# Altium schematic sheet Power.SchDoc
size 420 x 297 mm; SheetNumber: 2; SheetTotal: 6
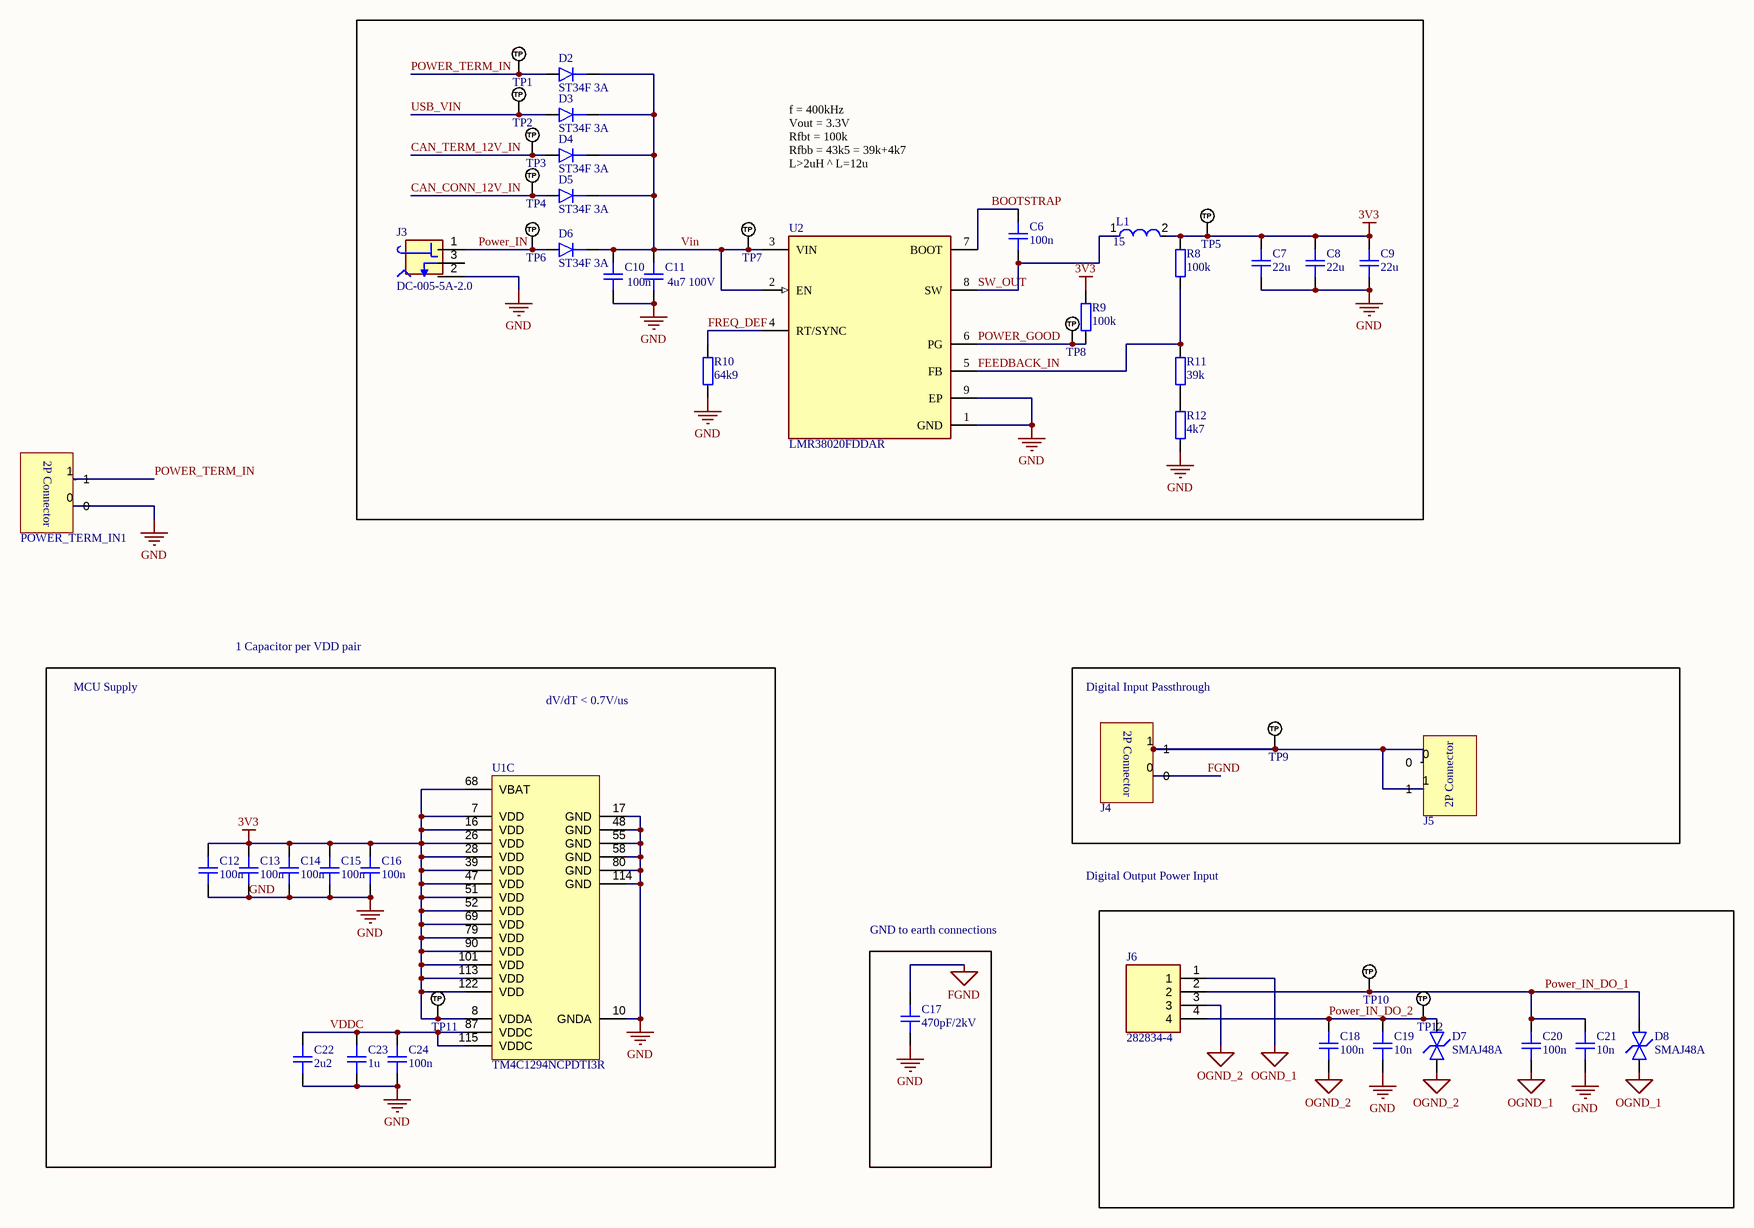
[diagram p0: Power.SchDoc]

## Parts
C6  100n  [CAP_0402]
C7  22u  [CAP_1206]
C8  22u  [CAP_1206]
C9  22u  [CAP_1206]
C10  100n  [CAP_1206]
C11  4u7 100V  [CAP_1206]
C12  100n  [CAP_0402]
C13  100n  [CAP_0402]
C14  100n  [CAP_0402]
C15  100n  [CAP_0402]
C16  100n  [CAP_0402]
C17  470pF/2kV  [CAP_1206]
C18  100n  [CAP_0603]
C19  10n  [CAP_0603]
C20  100n  [CAP_0603]
C21  10n  [CAP_0603]
C22  2u2  [CAP_0402]
C23  1u  [CAP_0402]
C24  100n  [CAP_0402]
D2  ST34F 3A  [DO-214AC-2 (SMA)]
D3  ST34F 3A  [DO-214AC-2 (SMA)]
D4  ST34F 3A  [DO-214AC-2 (SMA)]
D5  ST34F 3A  [DO-214AC-2 (SMA)]
D6  ST34F 3A  [DO-214AC-2 (SMA)]
D7  SMAJ48A  [DO-214AC-2 (SMA)]
D8  SMAJ48A  [DO-214AC-2 (SMA)]
J3  DC-005-5A-2.0  [XKB_DC-005-5A-2.0]
J4  DG308-2.54-02P-12-00AH  [DG308-2.54-02P-12-00AH-Footprint-1]  (value not drawn)
J5  DG308-2.54-02P-12-00AH  [DG308-2.54-02P-12-00AH-Footprint-1]  (value not drawn)
J6  282834-4  [TE_282834-4]
L1  15  [FP-SPM10040-MFG]
POWER_TERM_IN1  DG308-2.54-02P-12-00AH  [DG308-2.54-02P-12-00AH-Footprint-1]  (value not drawn)
R8  100k  [RES_0402]
R9  100k  [RES_0402]
R10  64k9  [RES_0402]
R11  39k  [RES_0402]
R12  4k7  [RES_0402]
TP1  TP_NOBOM  [PAD_RND_1MM]  (value not drawn)  (no BOM)
TP2  TP_NOBOM  [PAD_RND_1MM]  (value not drawn)  (no BOM)
TP3  TP_NOBOM  [PAD_RND_1MM]  (value not drawn)  (no BOM)
TP4  TP_NOBOM  [PAD_RND_1MM]  (value not drawn)  (no BOM)
TP5  TP_NOBOM  [PAD_RND_1MM]  (value not drawn)  (no BOM)
TP6  TP_NOBOM  [PAD_RND_1MM]  (value not drawn)  (no BOM)
TP7  TP_NOBOM  [PAD_RND_1MM]  (value not drawn)  (no BOM)
TP8  TP_NOBOM  [PAD_RND_1MM]  (value not drawn)  (no BOM)
TP9  TP_NOBOM  [PAD_RND_1MM]  (value not drawn)  (no BOM)
TP10  TP_NOBOM  [PAD_RND_1MM]  (value not drawn)  (no BOM)
TP11  TP_NOBOM  [PAD_RND_1MM]  (value not drawn)  (no BOM)
TP12  TP_NOBOM  [PAD_RND_1MM]  (value not drawn)  (no BOM)
U1  TM4C1294NCPDTI3R  [PDT0128A_M]  (part C of 3)
U2  LMR38020FDDAR  [FP-DDA0008E-IPC_C]

## Blocks framed on the sheet
Digital Input Passthrough: J4 J5 TP9
GND to earth connections: C17

## Nets
3V3: C7.2 C8.2 C9.2 C12.2 C13.2 C14.2 C15.2 C16.2 L1.2 R8.2 R9.2 TP5.1(TP) TP11.1(TP) U1.7(VDD) U1.8(VDDA) U1.16(VDD) U1.26(VDD) U1.28(VDD) U1.39(VDD) U1.47(VDD) U1.51(VDD) U1.52(VDD) U1.68(VBAT) U1.69(VDD) U1.79(VDD) U1.90(VDD) U1.101(VDD) U1.113(VDD) U1.122(VDD)
FGND: C17.2 J4.0
GND: C7.1 C8.1 C9.1 C10.1 C11.1 C12.1 C13.1 C14.1 C15.1 C16.1 C17.1 C19.1 C21.1 C22.1 C23.1 C24.1 J3.2 POWER_TERM_IN1.0 R10.1 R12.1 U1.10(GNDA) U1.17(GND) U1.48(GND) U1.55(GND) U1.58(GND) U1.80(GND) U1.114(GND) U2.1(GND) U2.9(EP)
OGND_1: C20.1 D8.A J6.1
OGND_2: C18.1 D7.A J6.3
BOOTSTRAP: C6.2 U2.7(BOOT)
CAN_CONN_12V_IN: D5.A TP4.1(TP)
CAN_TERM_12V_IN: D4.A TP3.1(TP)
FEEDBACK_IN: R8.1 R11.2 U2.5(FB)
FREQ_DEF: R10.2 U2.4(RT/SYNC)
POWER_GOOD: R9.1 TP8.1(TP) U2.6(PG)
Power_IN: D6.A J3.1 TP6.1(TP)
Power_IN_DO_1: C20.2 C21.2 D8.K J6.2 TP10.1(TP)
Power_IN_DO_2: C18.2 C19.2 D7.K J6.4 TP12.1(TP)
POWER_TERM_IN: D2.A POWER_TERM_IN1.1 TP1.1(TP)
SW_OUT: C6.1 L1.1 U2.8(SW)
USB_VIN: D3.A TP2.1(TP)
VDDC: C22.2 C23.2 C24.2 U1.87(VDDC) U1.115(VDDC)
Vin: C10.2 C11.2 D2.K D3.K D4.K D5.K D6.K TP7.1(TP) U2.2(EN) U2.3(VIN)
NetJ4_1: J4.1 J5.0 J5.1 TP9.1(TP)
NetR11_1: R11.1 R12.2

Not connected (* = marked no-connect by the designer): J3 3

## Notes on the sheet
- f = 400kHz
  Vout = 3.3V
  Rfbt = 100k
  Rfbb = 43k5 = 39k+4k7
  L>2uH ^ L=12u
- 1 Capacitor per VDD pair
- MCU Supply
- dV/dT < 0.7V/us
- Digital Output Power Input
- THIS DOCUMENT AND THE DATA DISCLOSED HEREIN OR
- HEREWITH IS THE PROPERTY OF ALTIUM LIMITED AND MAY
- DWG NO:
- REVISION
- REV:
- DESCRIPTION
- DATE
- APPROVED
- BE FREELY DISTRIBUTED IN WHOLE. NO RIGHTS ARE
- RESERVED OR EXPRESS OR IMPLIED WARANTEE GIVEN.
- ENG:
- APPROVALS
- PROJECT
- DSN:
- CHK:
- REFERENCE DOCUMENTS
- PROJECT REVISION:
- TITLE
- DOCUMENT REVISION:
- DESIGN ITEM:
- BOM:
- FAB DWG:
- PCB DWG:
- ASSY DWG:
- SCALE:
- A3
- SIZE
- CAGE CODE
- FILE NAME
- DWG NO.
- SHEET
- OF
- REV
- (in symbol CMP-002-00074-3) 2P Connector

## Library data of the parts
C6 C12-C16 C22-C24 = CAP_0402: Capacitor SMD 0402; Manufacturer: *; Manufacturer Part Number: *; Distributor Link: *; LCSC: *; Rating: *; Dielectric: *
C7-C11 C17 = CAP_1206: Capacitor SMD 1206; Manufacturer: *; Manufacturer Part Number: *; Distributor Link: *; LCSC: *; Rating: *; Dielectric: *
C18-C21 = CAP_0603: Capacitor SMD 0603; Manufacturer: *; Manufacturer Part Number: *; Distributor Link: *; LCSC: *; Rating: *; Dielectric: *
D2-D6 = D_SMA: Diode SMD SMA (DO-214AA)
D7 D8 = D_TVS_BI_SMC: Diode TVS / ESD Bidirectional SMC (DO-214AB); Manufacturer Part Number: *; Manufacturer: *; Distributor Link: *
J3 = CMP-002-00075-8: DC Power Receptacle Jack, Through Holeï¼ŒRight Angle; MF: XKB Industrial Precision; Value: *; Pins: 3; MP: DC-005-5A-2.0; Check_prices: https://www.snapeda.com/parts/DC-005-5A-2.0/XKB+Industrial+Precision/view-part/?ref=eda; Design Item ID: DC-005-5A-2.0; Source: DC-005-5A-2.0.SchLib; Component Type: Standard; Price: None; Case/Package: Package; SnapEDA_Link: https://www.snapeda.com/parts/DC-005-5A-2.0/XKB+Industrial+Precision/view-part/?ref=snap; Availability: Not in stock
J4 J5 POWER_TERM_IN1 = CMP-002-00074-3: 1x2P -40℃~+105℃ 8A 130V Green 18~26 Straight 2.54mm 0.5~1 1 2 Plugin,P=2.54mm Screw terminal ROHS
J6 = 282834-4: 4 Position Wire to Board Terminal Block Horizontal with Board 0.100 (2.54mm) Through Hole; MF: TE Connectivity; Package: None; MP: 282834-4; Price: None; Value: *; Availability: In Stock; Check_prices: https://www.snapeda.com/parts/282834-4/TE+Connectivity+AMP+Connectors/view-part/?ref=eda; Purchase-URL: https://pricing.snapeda.com/search/part/282834-4/?ref=eda; EU_RoHS_Compliance: Compliant with Exemptions; SnapEDA_Link: https://www.snapeda.com/parts/282834-4/TE+Connectivity+AMP+Connectors/view-part/?ref=snap
L1 = CMP-08253-000004-1: FIXED IND 2.2UH 16.7A 7.46MOHM; Manufacturer: TDK; Manufacturer Part Number: SPM10040T-2R2M-HZ; Test Frequency: 100kHz; Tolerance: 20%; Automotive Grade: Grade 1; Saturation Current: 13A; Shielding: true; Series Resistance: 7.48mΩ; Core Material: Metal; Lead Free: Yes; Rms Current: 16.7A; Category: Ind; Temperature Range High: +125°C; Device Class L1: Passive Components; Inductance: 2.2uH; RoHS: TRUE; Device Class L2: Inductors; ComponentLink2URL: https://product.tdk.com/info/en/catalog/datasheets/inductor_automotive_power_spm10040-hz_en.pdf; Device Class L3: Fixed Inductors; Temperature: -40°C to +125°C; Octopart: https://octopart.com/spm10040t-2r2m-hz-tdk-91421299; Package: SPM10040; Height: 4mm; Composition: Wirewound; Temperature Range Low: -40°C; Automotive: Yes; ComponentLink2Description: Datasheet; Mouser Description: Inductor Power Shielded Wirewound 2.2uH 20% 100KHz Metal 16.7A 0.00746Ohm DCR Automotive T/R; Digikey Description: FIXED IND 2.2UH 16.7A 7.46MOHM; Value: 2.2uH
R8-R12 = RES_0402: Resistor SMD 0402; Manufacturer: *; Manufacturer Part Number: *; Distributor Link: *; LCSC: *
TP1-TP12 = TEST_POINT_RND_1MM: Test Point Round 1mm (NO BOM)
U1 = CMP-0945-00007-2: Tiva C Series Microcontroller, 1024 KB Flash, 256 KB SRAM, 12 Bit, 20 Channels, -40 to 85 degC, 128-Pin TQFP (PDT), Green (RoHS & no Sb/Br), Tape and Reel; Manufacturer: Texas Instruments; SRAM: 256 KB; ADC Resolution: 12 Bits; Max Speed: 120 MHz; CPU: ARM Cortex-M4; ADC Channels: 20; Flash: 1024 KB; ComponentLink1Description: Manufacturer URL; PartNumber: TM4C1294NCPDTI3R; ComponentLink2URL: http://www.ti.com/lit/ds/symlink/tm4c1294ncpdt.pdf; ComponentLink1URL: http://www.ti.com/; Packing: Tape and Reel; PackageReference: PDT0128A; PackageVersion: 4087726/A; Temperature Range: -40 to 85 degC; ComponentLink2Description: Datasheet; DatasheetVersion: 15863.2743; ComponentLink3URL: http://www.ti.com/lit/ml/mpqf013/mpqf013.pdf; ComponentLink3Description: Package Specification; Mounting Technology: Surface Mount; Eco-Plan: Green (RoHS & no Sb/Br); PackageDescription: 128-Pin Thin Quad Flat Package, Body 14 x 14 mm, Pitch 0.4 mm
U2 = CMP-04918-000734-1: 4.2-V to 80-V, 2-A Synchronous Buck Converter with 40-µA IQ